# Altium schematic sheet Topsheet.SchDoc
size A4; SheetNumber: 1; SheetTotal: 6
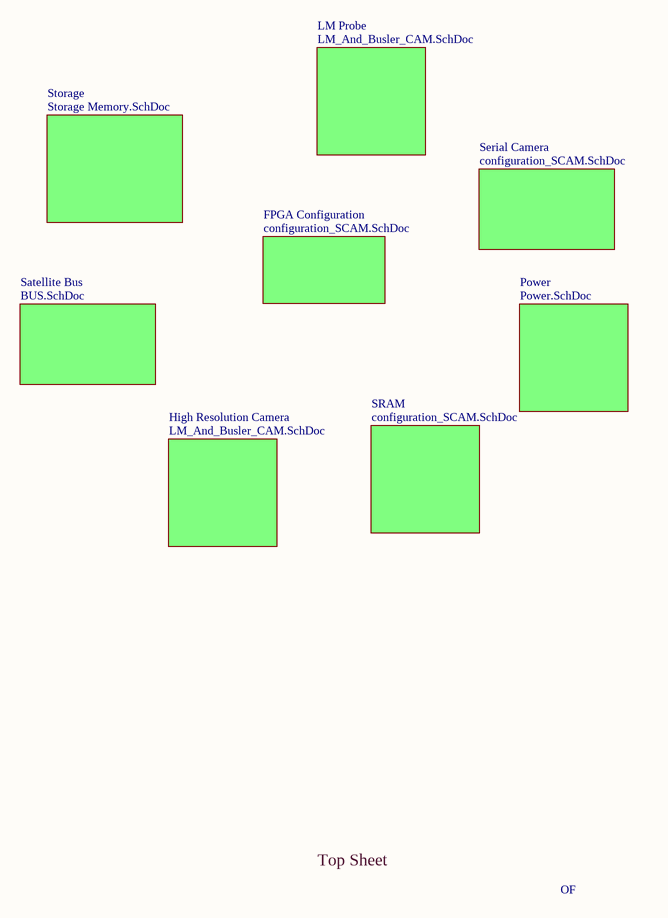
[diagram p0: Topsheet.SchDoc]

## Sub-sheets
FPGA Configuration = configuration_SCAM.SchDoc: no entries
High Resolution Camera = LM_And_Busler_CAM.SchDoc: no entries
LM Probe = LM_And_Busler_CAM.SchDoc: no entries
Power = Power.SchDoc: no entries
Satellite Bus = BUS.SchDoc: no entries
Serial Camera = configuration_SCAM.SchDoc: no entries
SRAM = configuration_SCAM.SchDoc: no entries
Storage = Storage Memory.SchDoc: no entries

## Notes on the sheet
- Top Sheet
- OF